# Altium schematic sheet SAMR21_Xplained_Pro_Antenna.SchDoc: Antenna
size A3; Organization: ATMEL Norway; Address1: Vestre Rosten 79; Address2: N-7075 TILLER; Address3: NORWAY; DocumentNumber: A09-2127; Revision: 3; SheetNumber: 4; SheetTotal: 7; PageSetup: Record=PageOptions|CenterHorizontal=True|CenterVertical=True|PrintScale=0.68|XCorrection=1.00|YCorrection=1.00|PrintKind=0|BorderSize=5000000|LeftOffset=0|BottomOffset=0|Orientation=2|PaperLength=1000|PaperWidth=1000|Scale=100|PaperSource=7|PrintQuality=-4|MediaType=1|DitherType=10|PaperKind=Letter|PrintScaleMode=1
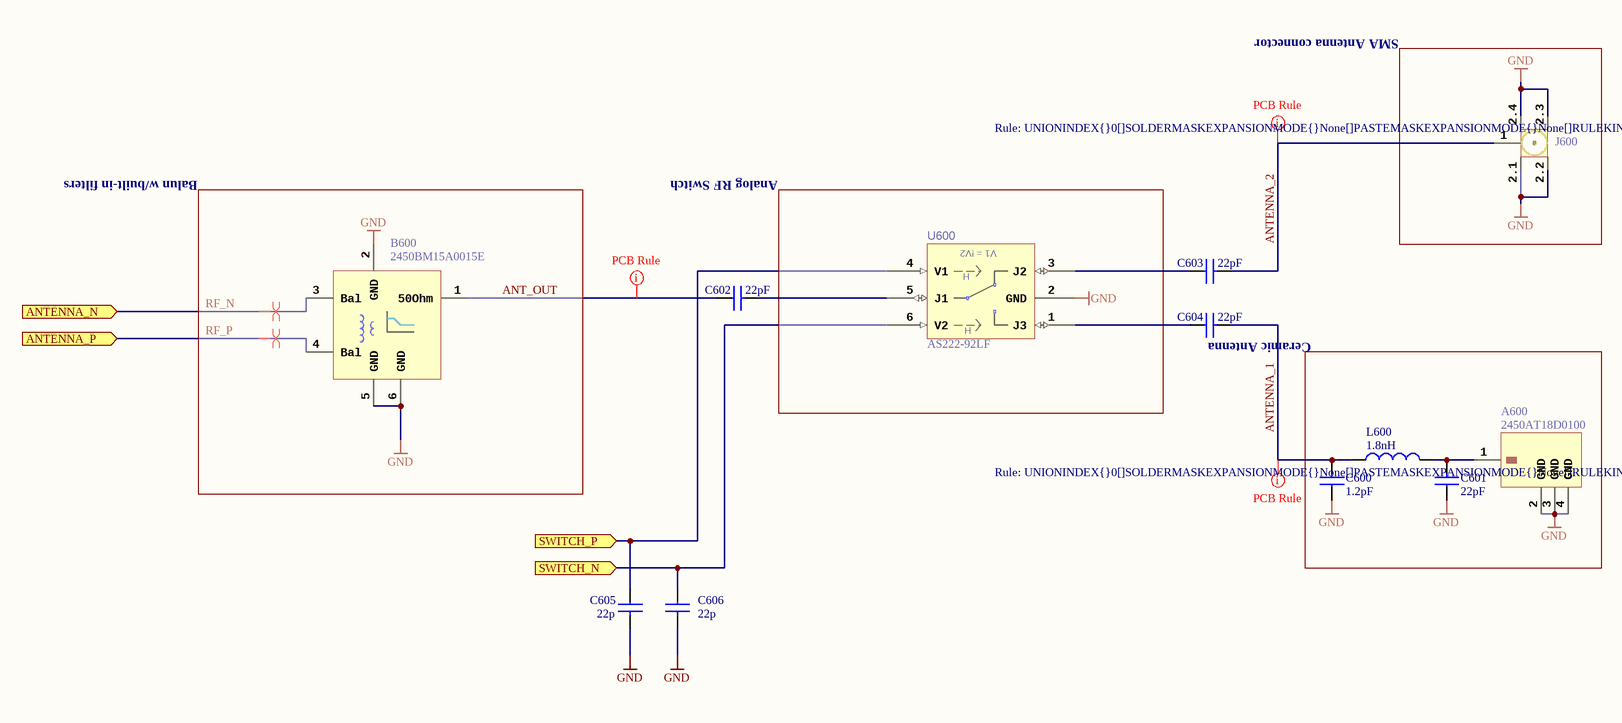
[diagram p0: SAMR21_Xplained_Pro_Antenna.SchDoc]

## Parts
A600  value 2450AT18D0100  [AP8-00678]  (hidden comment: ANT_CERAMIC_4pin)
B600  value 2450BM15A0015E  [AP3-00060]  (hidden comment: New part development in cooperation ATMEL/JTI)
C600  value 1.2pF  [AP1-00035]  (hidden comment: This 1.2pF capacitor is used for RF antennae tuning and can not be replaced by alternatives.)
C601  value 22pF  [AP1-00035]  (hidden comment: This 22pF capacitor cannot be replaced by A01-0311 in ZigBits)
C602  value 22pF  [AP1-00035]  (hidden comment: This 22pF capacitor cannot be replaced by A01-0311 in ZigBits)
C603  value 22pF  [AP1-00035]  (hidden comment: This 22pF capacitor cannot be replaced by A01-0311 in ZigBits)
C604  value 22pF  [AP1-00035]  (hidden comment: This 22pF capacitor cannot be replaced by A01-0311 in ZigBits)
C605  value 22p  [AP1-00001]  (hidden comment: CAP-NONPOL)
C606  value 22p  [AP1-00001]  (hidden comment: CAP-NONPOL)
J600  Footprint fits SPC, Tyco and Johnson components footprint  [AP8-00416]  (value not drawn)
L600  value 1.8nH  [AP2-00028]  (hidden comment: INDUCTOR)
U600  value AS222-92LF  [AP6-00227]  (hidden comment: AS222-92)

## Blocks framed on the sheet
SMA Antenna connector: J600
Balun w/built-in filters: B600
Analog RF Switch: U600
Ceramic Antenna: A600 C600 C601 L600

## Ports
ANTENNA_N (in), ANTENNA_P (in), SWITCH_N (in), SWITCH_P (in)

## Nets
GND: A600.2(GND) A600.3(GND) A600.4(GND) B600.2(GND) B600.5(GND) B600.6(GND) C600.1 C601.1 C605.2 C606.2 J600.2.1(GND1) J600.2.2(GND2) J600.2.3(GND3) J600.2.4(GND4) U600.2(GND)
ANT_OUT: B600.1(50Ohm) C602.1
ANTENNA_1: C600.2 C604.2 L600.2
ANTENNA_2: C603.2 J600.1(Core)
RF_N: B600.3(Bal) ; port ANTENNA_N
RF_P: B600.4(Bal) ; port ANTENNA_P
SWITCH_N: C606.1 U600.6(V2) ; port SWITCH_N
SWITCH_P: C605.1 U600.4(V1) ; port SWITCH_P
NetA600_1: A600.1(A) C601.2 L600.1
NetC602_2: C602.2 U600.5(J1)
NetC603_1: C603.1 U600.3(J2)
NetC604_1: C604.1 U600.1(J3)

## Layout directives
differential pair: RF_N, RF_P
rule Impedance Constraint [Min = 48.00    Max = 52.00    ]: ANT_OUT, ANTENNA_1, ANTENNA_2

## Notes on the sheet
- Date:
- PAGE:
- of
- TITLE:
- Document number:
- Revision:
- (in symbol A06-0560) V1 = !V2; H

## Library data of the parts
A600 = A08-1618: 2.45 GHz Ceramic Antenna; PartGroup: Mechanical devices,Antenna; Manufacturer: Johanson Technology; TemperatureRange: -40 to +85°C; AN: A08-1618; Height: 1.39999997615814; MPN: 2450AT18D0100
B600 = A03-0091: Filtered Balun to match AT86RF232/233 (35288); PartGroup: Inductors,RF,Other RF; Manufacturer: Johanson Technology; AN: A03-0091; Height: 0,800000011920929; MPN: 2450BM15A0015E
C600 = A01-0612: Ceramic Capacitor, SMD 0201, 25V, NP0, 1.2pF; PartGroup: Capacitors,Ceramic,SMD 0201; AN: A01-0612
C601-C604 = A01-0335: Ceramic Capacitor, SMD 0201, 25V, NP0, 22PF; PartGroup: Capacitors,Ceramic,SMD 0201; Manufacturer: Johanson Technology; MPN: 250R05L220JV4T; AN: A01-0335
C605 C606 = A01-0019: Ceramic capacitor, SMD 0402, NP0, 50V, +/-5%; PartGroup: Capacitors,Ceramic,SMD 0402; TemperatureRange: -55 - +125 deg C; AN: A01-0019; Tolerance: 50V, +/-5%; Height: 0.550000011920929
J600 = A08-0963: SMA PCB mounted connector 50Ohm (de19205); PartGroup: Mechanical devices,Connectors,Coaxial; Manufacturer: Multicomp; Value: 19-46-1-TGG; TemperatureRange: -65 - +165 deg C; AN: A08-0963; MPN: 19-46-1-TGG; Height: 13
L600 = A03-0148: ceramic chip inductor, 1.8nH,0201; PartGroup: Inductors,RF,SMD 0201; Manufacturer: Johanson Technology; MPN: L-05B1N8SV6T; Tolerance: ±0.3nH; TemperatureRange: -40°C ~ 100°C; AN: A03-0148
U600 = A06-0560: PHEMT SPDT Analog SWITCH, 0,1-3 GHz; PartGroup: Integrated Circuits,General linear,Analog switch, bus switch and MUX; Manufacturer: SKYWORKS SOLUTIONS; TemperatureRange: -40°C to +85°C; AN: A06-0560; Height: 0,949999988079071; MPN: AS222-92LF